# EAGLE design RelayBypass (EAGLE 9.6.2)
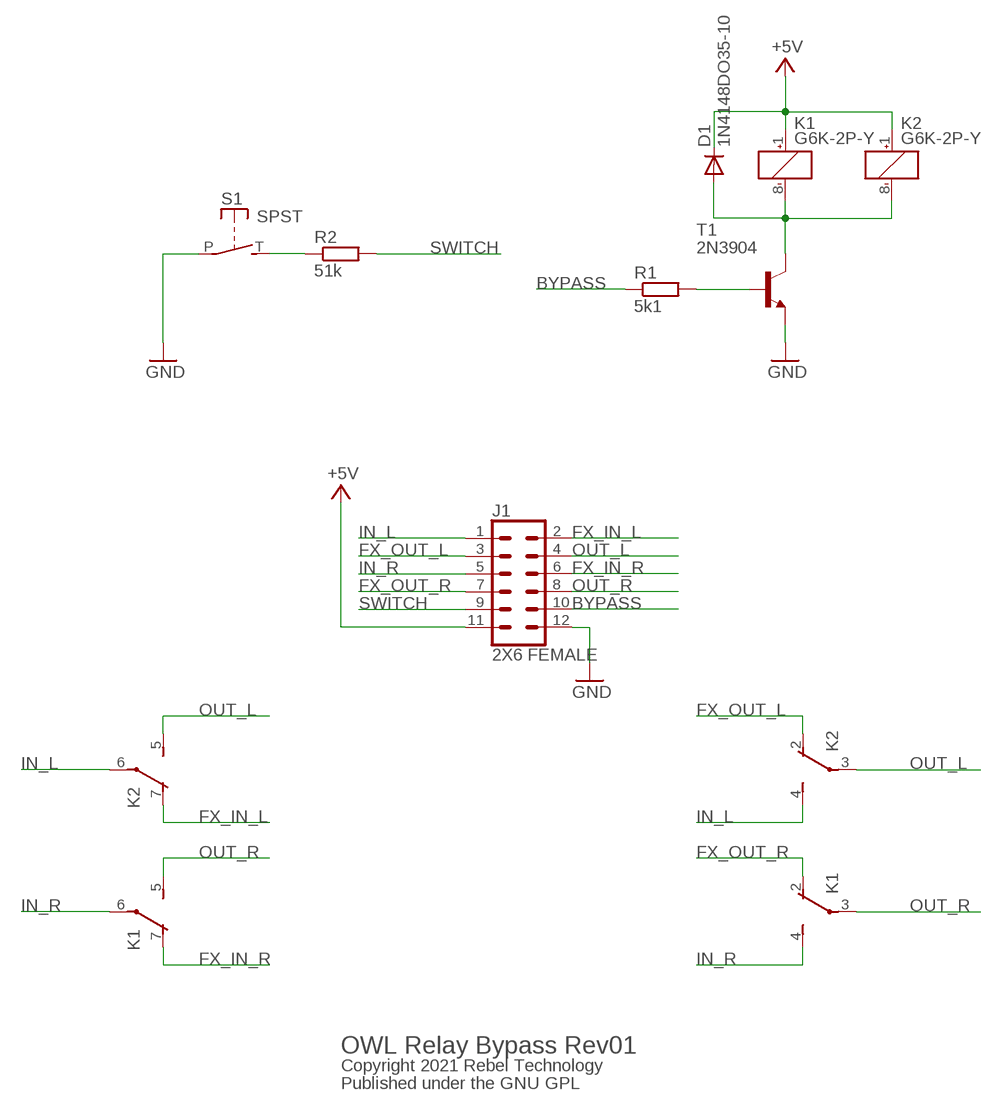
[diagram p0: schematic, sheet 1]

## Parts
D1  1N4148DO35-10  [DO35-10]
J1  2X6 FEMALE  CONN_06X2PTH_FEMALE  [2X6]
K1  G6K-2P-Y  [G6K-2P-Y]
K2  G6K-2P-Y  [G6K-2P-Y]
R1  5k1  R-EU_0204/7  [0204/7]
R2  51k  R-EU_0204/7  [0204/7]
S1  SPST  [JUDCOSPST]
T1  2N3904  [TO92]

## Nets
+5V: D1.C J1.11 K1.1(1:+) K2.1(1:+)
BYPASS: J1.10 R1.1
FX_IN_L: J1.2 K2.7(3:O)
FX_IN_R: J1.6 K1.7(3:O)
FX_OUT_L: J1.3 K2.2(2:O)
FX_OUT_R: J1.7 K1.2(2:O)
GND: J1.12 S1.P T1.3(E)
IN_L: J1.1 K2.4(2:S) K2.6(3:P)
IN_R: J1.5 K1.4(2:S) K1.6(3:P)
N$1: R1.2 T1.2(B)
N$2: D1.A K1.8(1:-) K2.8(1:-) T1.1(C)
N$3: R2.1 S1.T(S)
OUT_L: J1.4 K2.3(2:P) K2.5(3:S)
OUT_R: J1.8 K1.3(2:P) K1.5(3:S)
SWITCH: J1.9 R2.2

## Notes on the sheet
- OWL Relay Bypass Rev01
- Copyright 2021 Rebel Technology
- Published under the GNU GPL

## Library data of the parts
D1 = diode:1N4148: DIODE high speed (Philips)
J1 = SparkFun-Connectors:CONN_06X2: Multi connection point. Often used as Generic Header-pin footprint for 0.1 inch spaced/style header connections On any of the 0.1 inch spaced packages, you can populate with these: Break Away Headers - Straight <https://www.sparkfun.com/products/116> (PRT-00116) Break Away Male Headers - Right Angle <https://www.sparkfun.com/products/553> (PRT-00553) Female Headers <https://www.sparkfun.com/products/115> (PRT-00115) Break Away Headers - Machine Pin <https://www.sparkfun.com/products/117> (PRT-00117) Break Away Female Headers - Swiss Machine Pin <https://www.sparkfun.com/products/743> (PRT-00743); PROD_ID: CONN-12423
K1 K2 = relay:G6K: Low Signal Relay oeiwcsnts1.omron.com/.. D20G6K0100.pdf; MF: OMRON COMPONENTS USA; MPN: G6K-2P-Y DC12; OC_FARNELL: 3937276; OC_NEWARK: 34C3464
R1 R2 = Rebel:R-EU_: RESISTOR, European symbol
S1 = adafruit:SPST: Judco 50-0015-00
T1 = transistor:2N3904: NPN TRANSISTOR

## Board
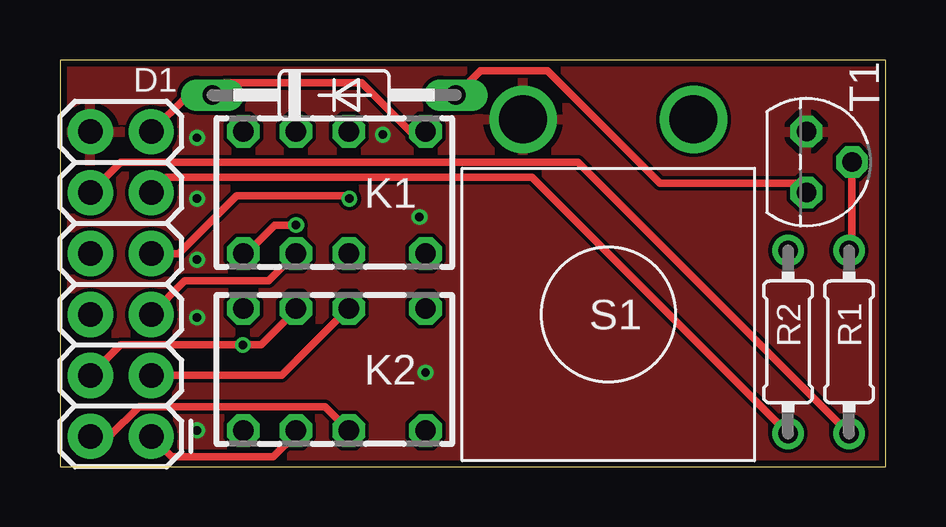
[diagram p1: board, top side]
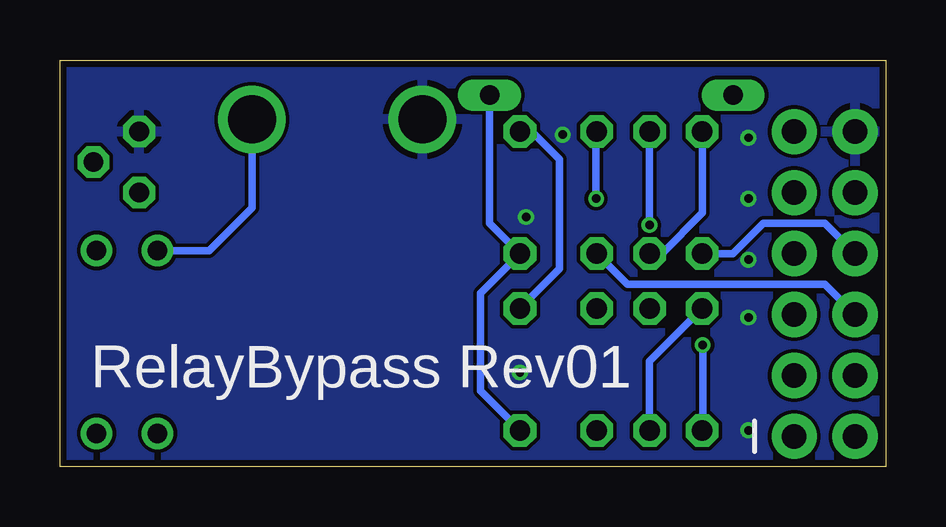
[diagram p2: board, bottom side, seen from below]

Size 34.42 x 16.95 mm. Coordinates in mm from the lower left corner, seen from the top.
Outline: 0,0 34.42,0 34.42,16.96 0,16.96 0,0
Copper layers (1*16): Top 0.035mm / dielectric 1.5mm / Bottom 0.035mm
Design rules "Rebel *": minimum track width 6mil, minimum drill 12mil, track to track 6mil, track to pad 6mil, pad to pad 6mil, via to via 6mil, smd to smd 0mil, copper to edge 10mil, drill to drill 10mil, minimum pad ring 10mil, minimum via ring 6mil, stop-mask expansion 2mil, vias tented up to drill 100mil, thermal gap 10mil

### Footprints (pad centres in the part's own frame; a part is rotated, then mirrored left to right if it is on the bottom)
DO35-10 = drill 0.813 long: A 5.08,0; C -5.08,0
2X6 = drill 1.016 pad 1.88: 1 0,0; 2 0,2.54; 3 2.54,0; 4 2.54,2.54; 5 5.08,0; 6 5.08,2.54; 7 7.62,0; 8 7.62,2.54; 9 10.16,0; 10 10.16,2.54; 11 12.7,0; 12 12.7,2.54
G6K-2P-Y = drill 0.85 octagon: 1 0,-2.54; 2 3.2,-2.54; 3 5.4,-2.54; 4 7.6,-2.54; 5 7.6,2.54; 6 5.4,2.54; 7 3.2,2.54; 8 0,2.54
0204/7 = drill 0.813: 1 -3.81,0; 2 3.81,0
JUDCOSPST = drill 2: P 3.556,-8.128; T -3.556,-8.128
TO92 = drill 0.813 octagon: 1 1.27,0; 2 0,1.905; 3 -1.27,0

### Placement (x,y rotation side)
D1  11.43,15.49 0 top
J1  3.81,1.27 90 top
K1  15.24,11.43 180 top
K2  15.24,4.06 180 top
R1  32.89,5.21 90 top
R2  30.35,5.21 270 top
S1  22.86,6.35 180 top
T1  31.12,12.7 270 top

### Tracks (layer width: path | path; a pad name or v marks a point on that pad's centre or on a via)
+5V
  Top 0.305: J1.11 5.33,15.49 D1.C 6.86,16 12.57,16 14.61,13.97 K1.1
  Bottom 0.305: K1.1 14.73,13.97 13.59,12.83 13.59,8.26 K2.1
BYPASS
  Top 0.305: J1.10 2.54,12.7 20.32,12.7 20.7,12.7 21.59,12.7 R1.1
FX_IN_L
  Top 0.305: J1.2 2.05,1.27 3.29,2.52 3.81,2.52 4.33,2.52 11.05,2.52 K2.7
FX_IN_R
  Bottom 0.305: J1.6 2.54,7.62 10.77,7.62 K1.7
FX_OUT_L
  Top 0.305: K2.2 9.25,3.81 J1.3
FX_OUT_R  (via drill 0.35)
  Top 0.305: J1.7 4.95,8.89 7.37,11.3 11.94,11.3 v12.07,11.18
  Bottom 0.305: v12.07,11.18 12.07,13.95 K1.2
GND  (via drill 0.35)
  other vias: 15.24,3.94 5.72,11.18 5.72,6.22 5.72,13.72 13.46,13.84 14.99,10.41 5.72,1.52 5.72,8.64
  pour Top: -1.27,17.78 35.56,17.78 35.56,-1.27 -1.27,-1.27
  pour Bottom: 0,17.78 36.83,17.78 36.83,-1.27 0,-1.27
IN_L
  Top 0.305: J1.1 4.66,0.42 8.89,0.42 9.84,1.37 K2.6
  Bottom 0.305: K2.4 9.84,4.4 K2.6
IN_R
  Top 0.305: J1.5 5.21,7.75 8.7,7.75 K1.6
  Bottom 0.305: K1.4 7.64,10.58 9.33,8.89 K1.6
N$1
  Top 0.305: T1.2 33.02,9.14 R1.2
N$2
  Top 0.305: 31.12,11.3 T1.1 30.73,11.81 25.02,11.81 20.32,16.51 17.53,16.51 D1.A
  Bottom 0.305: K2.8 16.89,3.18 16.89,7.24 K1.8 16.51,10.16 D1.A
N$3
  Bottom 0.305: R2.1 28.19,9.02 26.42,10.8 S1.T
OUT_L  (via drill 0.35)
  Top 0.305: J1.4 2.54,5.08 v7.62,5.08 8.38,5.08 9.84,6.54 K2.3
  Bottom 0.305: K2.5 7.62,1.54 v7.62,5.08
OUT_R  (via drill 0.35)
  Top 0.305: v9.84,10.07 8.95,10.07 7.77,8.89 K1.5
  Bottom 0.305: J1.8 2.54,10.16 5.1,10.16 6.37,8.89 K1.5 | K1.3 v9.84,10.07
SWITCH
  Top 0.305: J1.9 4.45,12.07 19.69,12.07 R2.2

### Text on the board
bPlace: RelayBypass Rev01